# Altium project EMOTION-GLASS-PCB-V0.0.PrjPcb
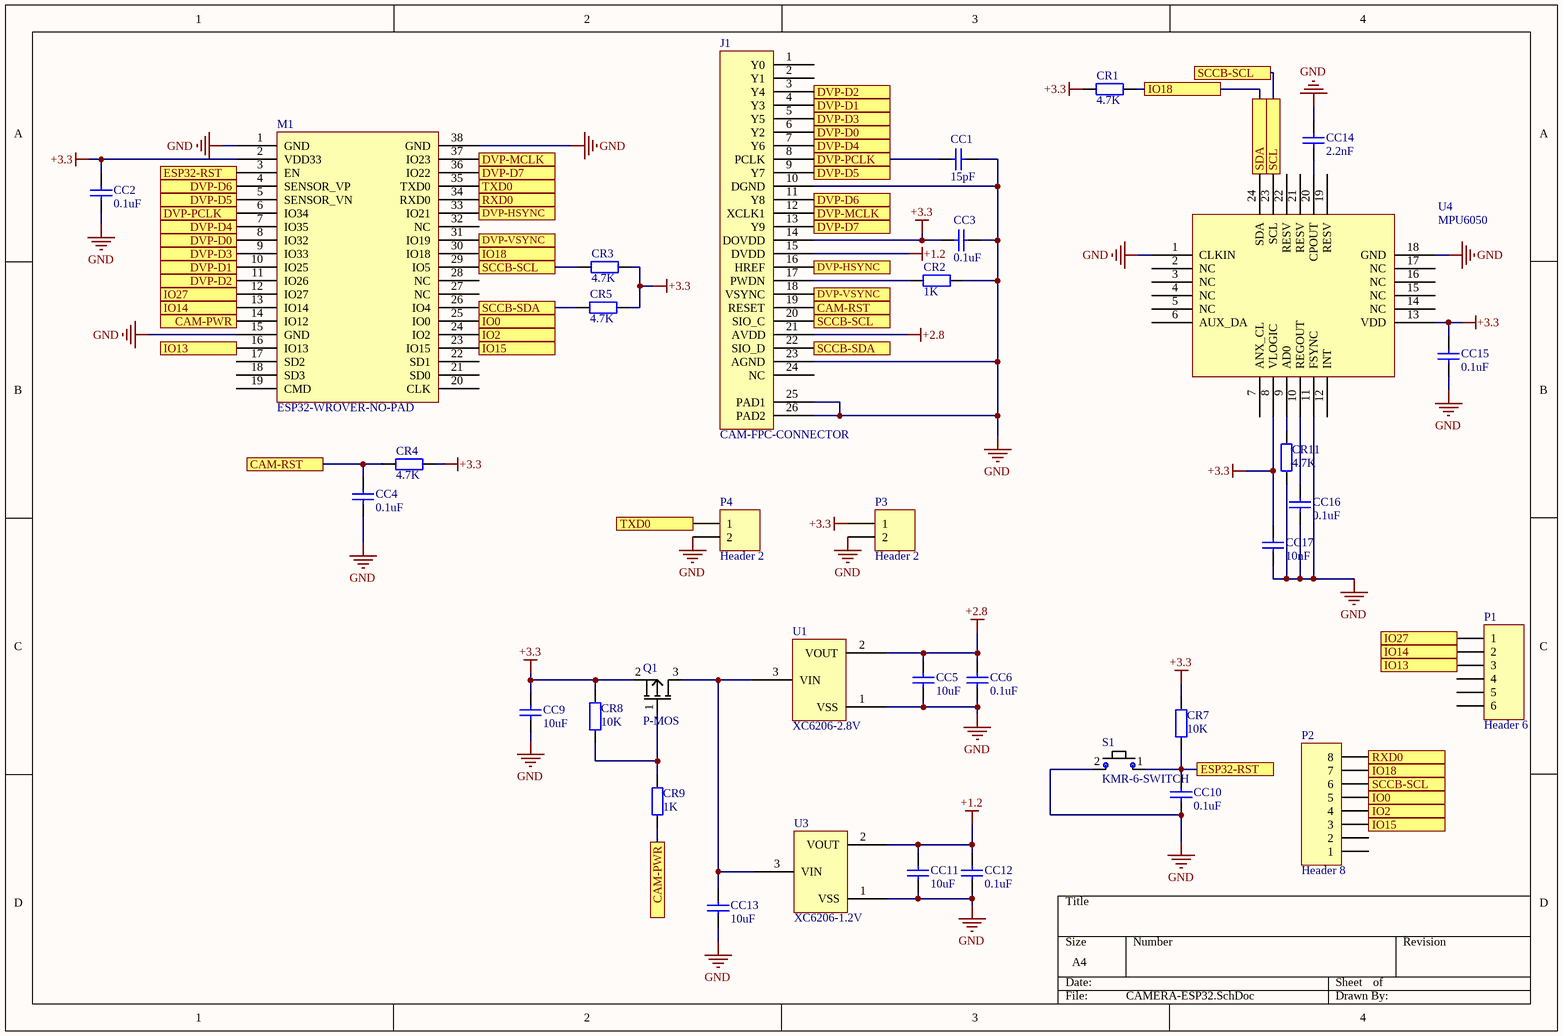
[diagram p0: CAMERA-ESP32.SchDoc]
1 sheet, 35 parts. Net scope: flat (ports and power ports of the same name join across sheets).
Board file: CAMERA-ESP32.PcbDoc

## Sheet CAMERA-ESP32.SchDoc: ACC-CAM
size A4; Date: 6/27/2019; DrawnBy: ) I D; Organization: Columbia ICSL; Revision: 0.0

### Parts
CC1  value 15pF  [CC1005-0402]  (hidden comment: Cap Chip 0402)
CC2  value 0.1uF  [CC1005-0402]  (hidden comment: Cap Chip 0402)
CC3  value 0.1uF  [CC1005-0402]  (hidden comment: Cap Chip 0402)
CC4  value 0.1uF  [CC1005-0402]  (hidden comment: Cap Chip 0402)
CC5  value 10uF  [CC1608-0603]  (hidden comment: Cap Chip 0603)
CC6  value 0.1uF  [CC1005-0402]  (hidden comment: Cap Chip 0402)
CC9  value 10uF  [CC1608-0603]  (hidden comment: Cap Chip 0603)
CC10  value 0.1uF  [CC1005-0402]  (hidden comment: Cap Chip 0402)
CC11  value 10uF  [CC1608-0603]  (hidden comment: Cap Chip 0603)
CC12  value 0.1uF  [CC1005-0402]  (hidden comment: Cap Chip 0402)
CC13  value 10uF  [CC1608-0603]  (hidden comment: Cap Chip 0603)
CC14  value 2.2nF  [CC1005-0402]  (hidden comment: Cap Chip 0402)
CC15  value 0.1uF  [CC1005-0402]  (hidden comment: Cap Chip 0402)
CC16  value 0.1uF  [CC1005-0402]  (hidden comment: Cap Chip 0402)
CC17  value 10nF  [CC1005-0402]  (hidden comment: Cap Chip 0402)
CR1  value 4.7K  [CR1005-0402]  (hidden comment: Resistor Chip 0402)
CR2  value 1K  [CR1005-0402]  (hidden comment: Resistor Chip 0402)
CR3  value 4.7K  [CR1005-0402]  (hidden comment: Resistor Chip 0402)
CR4  value 4.7K  [CR1005-0402]  (hidden comment: Resistor Chip 0402)
CR5  value 4.7K  [CR1005-0402]  (hidden comment: Resistor Chip 0402)
CR7  value 10K  [CR1005-0402]  (hidden comment: Resistor Chip 0402)
CR8  value 10K  [CR1005-0402]  (hidden comment: Resistor Chip 0402)
CR9  value 1K  [CR1005-0402]  (hidden comment: Resistor Chip 0402)
CR11  value 4.7K  [CR1005-0402]  (hidden comment: Resistor Chip 0402)
J1  CAM-FPC-CONNECTOR  [CAM-CONNECTOR]
M1  ESP32-WROVER-NO-PAD  [ESP32-WROVER-NO-PAD]
P1  Header 6  [HDR1X6]
P2  Header 8  [HDR1X8]
P3  Header 2  [HDR1X2]
P4  Header 2  [HDR1X2]
Q1  P-MOS  [PCBComponent_1]
S1  KMR-6-SWITCH  [KMR-6-SWITCH]
U1  XC6206-2.8V  [XC6206-SOT-23]
U3  XC6206-1.2V  [XC6206-SOT-23]
U4  MPU6050  [MPU-6050]

### Ports
CAM-PWR, CAM-RST, DVP-D0, DVP-D1, DVP-D2, DVP-D3, DVP-D4, DVP-D5, DVP-D6, DVP-D7, DVP-HSYNC, DVP-MCLK, DVP-PCLK, DVP-VSYNC, ESP32-RST, IO0, IO2, IO13, IO14, IO15, IO18, IO27, RXD0, SCCB-SCL, SCCB-SDA, SCL, SDA, TXD0

### Nets
+1.2: CC11.2 CC12.2 J1.15(DVDD) U3.2(VOUT)
+2.8: CC5.2 CC6.2 J1.21(AVDD) U1.2(VOUT)
+3.3: CC2.2 CC3.2 CC9.2 CC15.1 CC17.1 CR1.2 CR3.1 CR4.1 CR5.1 CR7.2 CR8.2 J1.14(DOVDD) M1.2(VDD33) P3.1 Q1.2 U4.8(VLOGIC) U4.13(VDD)
GND: CC1.1 CC2.1 CC3.1 CC4.2 CC5.1 CC6.1 CC9.1 CC10.1 CC11.1 CC12.1 CC13.1 CC14.1 CC15.2 CC16.2 CC17.2 CR2.1 CR11.2 J1.10(DGND) J1.23(AGND) J1.25(PAD1) J1.26(PAD2) M1.1(GND) M1.15(GND) M1.38(GND) P3.2 P4.2 S1.2 U1.1(VSS) U3.1(VSS) U4.1(CLKIN) U4.11(FSYNC) U4.18(GND)
NetCC1_2: CC1.2 J1.8(PCLK) M1.6(IO34) ; port DVP-PCLK
NetCC4_1: CC4.1 CR4.2 J1.19(RESET) ; port CAM-RST
NetCC10_2: CC10.2 CR7.1 M1.3(EN) S1.1 ; port ESP32-RST
NetCC13_2: CC13.2 Q1.3 U1.3(VIN) U3.3(VIN)
NetCC14_2: CC14.2 U4.20(CPOUT)
NetCC16_1: CC16.1 U4.10(REGOUT)
NetCR1_1: CR1.1 M1.30(IO18) P2.7 U4.24(SDA) ; port SDA, port IO18
NetCR2_2: CR2.2 J1.17(PWDN)
NetCR3_2: CR3.2 J1.20(SIO_C) M1.29(IO5) P2.6 U4.23(SCL) ; port SCCB-SCL, port SCL
NetCR5_2: CR5.2 J1.22(SIO_D) M1.26(IO4) ; port SCCB-SDA
NetCR8_1: CR8.1 CR9.2 Q1.1
NetCR9_1: CR9.1 M1.14(IO12) ; port CAM-PWR
NetCR11_1: CR11.1 U4.9(AD0)
NetJ1_3: J1.3(Y4) M1.11(IO26) ; port DVP-D2
NetJ1_4: J1.4(Y3) M1.10(IO25) ; port DVP-D1
NetJ1_5: J1.5(Y5) M1.9(IO33) ; port DVP-D3
NetJ1_6: J1.6(Y2) M1.8(IO32) ; port DVP-D0
NetJ1_7: J1.7(Y6) M1.7(IO35) ; port DVP-D4
NetJ1_9: J1.9(Y7) M1.5(SENSOR_VN) ; port DVP-D5
NetJ1_11: J1.11(Y8) M1.4(SENSOR_VP) ; port DVP-D6
NetJ1_12: J1.12(XCLK1) M1.37(IO23) ; port DVP-MCLK
NetJ1_13: J1.13(Y9) M1.36(IO22) ; port DVP-D7
NetJ1_16: J1.16(HREF) M1.33(IO21) ; port DVP-HSYNC
NetJ1_18: J1.18(VSYNC) M1.31(IO19) ; port DVP-VSYNC
NetM1_12: M1.12(IO27) P1.1 ; port IO27
NetM1_13: M1.13(IO14) P1.2 ; port IO14
NetM1_16: M1.16(IO13) P1.3 ; port IO13
NetM1_23: M1.23(IO15) P2.3 ; port IO15
NetM1_24: M1.24(IO2) P2.4 ; port IO2
NetM1_25: M1.25(IO0) P2.5 ; port IO0
NetM1_34: M1.34(RXD0) P2.8 ; port RXD0
NetM1_35: M1.35(TXD0) P4.1 ; port TXD0

Not connected (* = marked no-connect by the designer): J1 1(Y0) 2(Y1) 24(NC); M1 17(SD2) 18(SD3) 19(CMD) 20(CLK) 21(SD0) 22(SD1) 27(NC) 28(NC) 32(NC); P1 4 5 6; P2 1 2; U4 2(NC) 3(NC) 4(NC) 5(NC) 6(AUX_DA) 7(ANX_CL) 12(INT) 14(NC) 15(NC) 16(NC) 17(NC) 19(RESV) 21(RESV) 22(RESV)

### Library data of the parts
CC1-CC4 CC6 CC10 CC12 CC14-CC17 = Cap Chip 0402: Polarized Capacitor (Radial); Published: 8-Jun-2000; Revision: July-2002: Re-released for DXP Platform.; Publisher: Altium Limited
CC5 CC9 CC11 CC13 = Cap Chip 0603: Polarized Capacitor (Radial); Published: 8-Jun-2000; Revision: July-2002: Re-released for DXP Platform.; Publisher: Altium Limited
CR1-CR5 CR7-CR9 CR11 = Resistor Chip 0402: Resistor; Published: 8-Jun-2000; Revision: July-2002: Re-released for DXP Platform.; Publisher: Altium Limited
P1 = Header 6: Header, 6-Pin; LatestRevisionDate: 17-Jul-2002; LatestRevisionNote: Re-released for DXP Platform.; Publisher: Altium Limited
P2 = Header 8: Header, 8-Pin; LatestRevisionDate: 17-Jul-2002; LatestRevisionNote: Re-released for DXP Platform.; Publisher: Altium Limited
P3 P4 = Header 2: Header, 2-Pin; LatestRevisionDate: 17-Jul-2002; LatestRevisionNote: Re-released for DXP Platform.; Publisher: Altium Limited
U1 U3 = XC6206